# Altium project PLATE_FP_K2M_rev4_1.PrjPcb
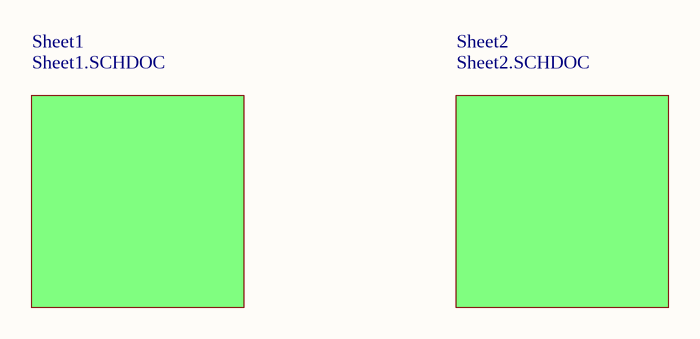
[diagram p0: First_Sheet.SCHDOC]
3 sheets, 58 parts. Net scope: global (net labels, ports and power ports of the same name join across sheets).
Board file: PLATE_FP_K2M_rev4_1.PcbDoc
Sheets:
  First_Sheet.SCHDOC
    Sheet1 = Sheet1.SCHDOC
    Sheet2 = Sheet2.SCHDOC

## Sheet First_Sheet.SCHDOC
size 421 x 298 mm

### Sub-sheets
Sheet1 = Sheet1.SCHDOC: no entries
Sheet2 = Sheet2.SCHDOC: no entries

## Sheet Sheet1.SCHDOC
size 421 x 298 mm; Revision: Rev.4.1; SheetNumber: 1; SheetTotal: 2; DocumentName: Sheet1.SCHDOC
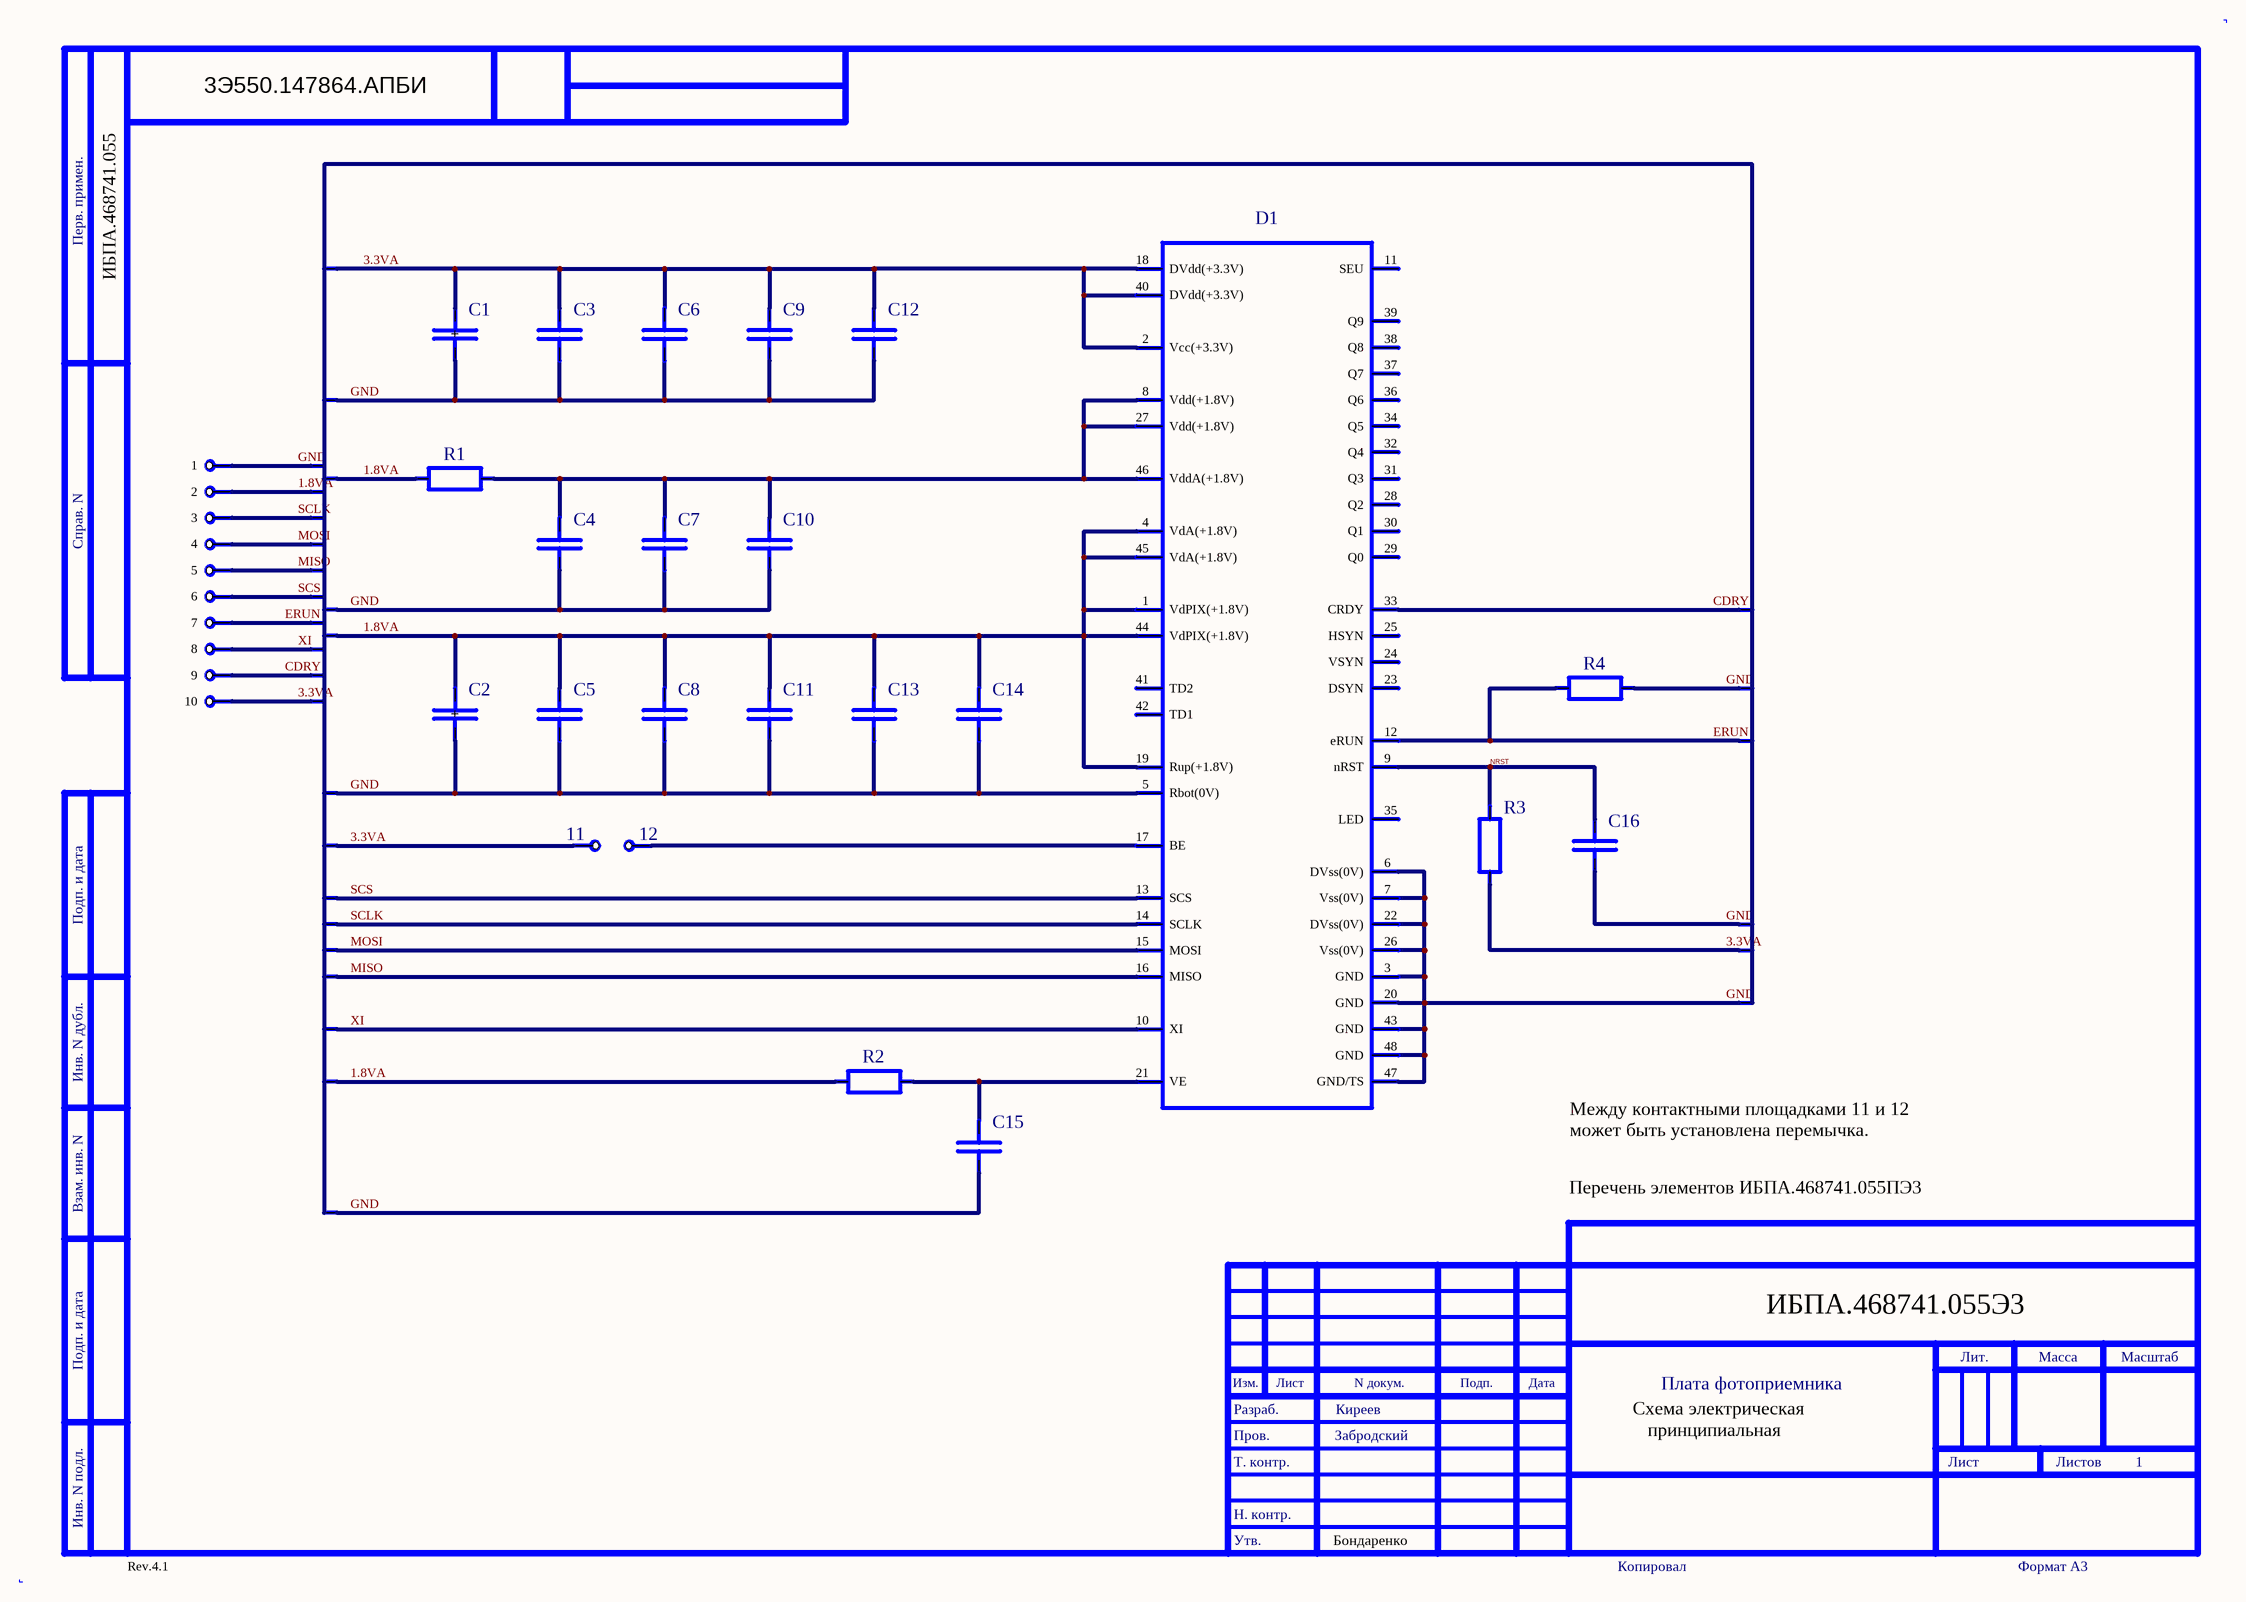
[diagram p1: Sheet1.SCHDOC]

### Parts
11  CONT_D1.0(0.6)MM  [CONT_D1.0(0.6)MM]  (value not drawn)
12  CONT_D1.0(0.6)MM  [CONT_D1.0(0.6)MM]  (value not drawn)
C1  K53-56A_3628M_2B  [CE_3628M_B]  (value not drawn)
C2  K53-56A_3628M_2B  [CE_3628M_B]  (value not drawn)
C3  K10-84B_1608M_I  [1608M_I]  (value not drawn)
C4  K10-84B_2012M_IV  [2012M_IV]  (value not drawn)
C5  K10-84B_2012M_IV  [2012M_IV]  (value not drawn)
C6  K10-84B_2012M_IV  [2012M_IV]  (value not drawn)
C7  K10-84B_2012M_IV  [2012M_IV]  (value not drawn)
C8  K10-84B_2012M_IV  [2012M_IV]  (value not drawn)
C9  K10-84B_2012M_IV  [2012M_IV]  (value not drawn)
C10  K10-84B_2012M_IV  [2012M_IV]  (value not drawn)
C11  K10-84B_2012M_IV  [2012M_IV]  (value not drawn)
C12  K10-84B_2012M_IV  [2012M_IV]  (value not drawn)
C13  K10-84B_2012M_IV  [2012M_IV]  (value not drawn)
C14  K10-84B_2012M_IV  [2012M_IV]  (value not drawn)
C15  K10-84B_2012M_IV  [2012M_IV]  (value not drawn)
C16  K10-84B_2012M_IV  [2012M_IV]  (value not drawn)
D1  UIC1203R  [CERAMIC_JLCC-48]  (value not drawn)
OFF1  BUS_CONNECTOR  (value not drawn)  (graphical)
OFF2  BUS_CONNECTOR  (value not drawn)  (graphical)
OFF3  BUS_CONNECTOR  (value not drawn)  (graphical)
OFF4  BUS_CONNECTOR  (value not drawn)  (graphical)
OFF5  BUS_CONNECTOR  (value not drawn)  (graphical)
OFF6  BUS_CONNECTOR  (value not drawn)  (graphical)
OFF7  BUS_CONNECTOR  (value not drawn)  (graphical)
OFF8  BUS_CONNECTOR  (value not drawn)  (graphical)
OFF9  BUS_CONNECTOR  (value not drawn)  (graphical)
OFF10  BUS_CONNECTOR  (value not drawn)  (graphical)
OFF11  BUS_CONNECTOR  (value not drawn)  (graphical)
OFF12  BUS_CONNECTOR  (value not drawn)  (graphical)
OFF13  BUS_CONNECTOR  (value not drawn)  (graphical)
OFF14  BUS_CONNECTOR  (value not drawn)  (graphical)
OFF15  BUS_CONNECTOR  (value not drawn)  (graphical)
OFF16  BUS_CONNECTOR  (value not drawn)  (graphical)
OFF17  BUS_CONNECTOR  (value not drawn)  (graphical)
OFF18  BUS_CONNECTOR  (value not drawn)  (graphical)
OFF19  BUS_CONNECTOR  (value not drawn)  (graphical)
OFF20  BUS_CONNECTOR  (value not drawn)  (graphical)
OFF21  BUS_CONNECTOR  (value not drawn)  (graphical)
OFF22  BUS_CONNECTOR  (value not drawn)  (graphical)
OFF23  BUS_CONNECTOR  (value not drawn)  (graphical)
OFF24  BUS_CONNECTOR  (value not drawn)  (graphical)
OFF25  BUS_CONNECTOR  (value not drawn)  (graphical)
OFF26  BUS_CONNECTOR  (value not drawn)  (graphical)
OFF27  BUS_CONNECTOR  (value not drawn)  (graphical)
OFF28  BUS_CONNECTOR  (value not drawn)  (graphical)
OFF29  BUS_CONNECTOR  (value not drawn)  (graphical)
OFF30  BUS_CONNECTOR  (value not drawn)  (graphical)
R1  P1-12-0,125_2012M  [R1-12_2012M_0805]  (value not drawn)
R2  P1-12-0,125_2012M  [R1-12_2012M_0805]  (value not drawn)
R3  P1-12-0,125_2012M  [R1-12_2012M_0805]  (value not drawn)
R4  P1-12-0,125_2012M  [R1-12_2012M_0805]  (value not drawn)
TP1  TMM-105-01-T-D  [TMM-105-01-G-D_SAMTEC]  (value not drawn)

### Nets
1.8VA: C2.1(+) C5.1 C8.1 C11.1 C13.1 C14.1 D1.1(VdPIX(+1.8V)) D1.4(VdA(+1.8V)) D1.19(Rup(+1.8V)) D1.44(VdPIX(+1.8V)) D1.45(VdA(+1.8V)) OFF2.1 OFF13.1 OFF15.1 OFF22.1 R1.1 R2.1 TP1.2
3.3VA: 11.1 C1.1(+) C3.1 C6.1 C9.1 C12.1 D1.2(Vcc(+3.3V)) D1.18(DVdd(+3.3V)) D1.40(DVdd(+3.3V)) OFF10.1 OFF11.1 OFF27.1 OFF30.1 R3.2 TP1.10
CDRY: D1.33(CRDY) OFF9.1 OFF23.1 TP1.9
ERUN: D1.12(eRUN) OFF7.1 OFF25.1 R4.1 TP1.7
GND: C1.2 C2.2 C3.2 C4.2 C5.2 C6.2 C7.2 C8.2 C9.2 C10.2 C11.2 C12.2 C13.2 C14.2 C15.2 C16.2 D1.3(GND) D1.5(Rbot(0V)) D1.6(DVss(0V)) D1.7(Vss(0V)) D1.20(GND) D1.22(DVss(0V)) D1.26(Vss(0V)) D1.43(GND) D1.47(GND/TS) D1.48(GND) OFF1.1 OFF12.1 OFF14.1 OFF16.1 OFF24.1 OFF26.1 OFF28.1 OFF29.1 R4.2 TP1.1
MISO: D1.16(MISO) OFF5.1 OFF20.1 TP1.5
MOSI: D1.15(MOSI) OFF4.1 OFF19.1 TP1.4
NRST: C16.1 D1.9(nRST) R3.1
SCLK: D1.14(SCLK) OFF3.1 OFF18.1 TP1.3
SCS: D1.13(SCS) OFF6.1 OFF17.1 TP1.6
XI: D1.10(XI) OFF8.1 OFF21.1 TP1.8
Net12_1: 12.1 D1.17(BE)
NetC4_1: C4.1 C7.1 C10.1 D1.8(Vdd(+1.8V)) D1.27(Vdd(+1.8V)) D1.46(VddA(+1.8V)) R1.2
NetC15_1: C15.1 D1.21(VE) R2.2

Not connected (* = marked no-connect by the designer): D1 11(SEU) 23(DSYN) 24(VSYN) 25(HSYN) 28(Q2) 29(Q0) 30(Q1) 31(Q3) 32(Q4) 34(Q5) 35(LED) 36(Q6) 37(Q7) 38(Q8) 39(Q9) 41(TD2) 42(TD1)

### Notes on the sheet
- 3Э550.147864.АПБИ
- Перв. примен.
- ИБПА.468741.055
- Справ. N
- Подп. и дата
- Инв. N дубл.
- Взам. инв. N
- Между контактными площадками 11 и 12
  может быть установлена перемычка.
- Перечень элементов ИБПА.468741.055ПЭ3
- ИБПА.468741.055Э3
- Разраб.
- Изм.
- Лист
- Киреев
- N докум.
- Подп.
- Дата
- Плата фотоприемника
- Лит.
- Масса
- Масштаб
- Т. контр.
- Пров.
- Забродский
- Схема электрическая
  принципиальная
- Листов
- 1
- Инв. N подл.
- Утв.
- Н. контр.
- Бондаренко
- Копировал
- Формат А3

### Library data of the parts
C1 C2 = K53-56A_3628M_2B: {Description}; Part Number: ОСМ К53-56А - 10 В - 10 мкФ ±10 % - В; Value: 10 мкФ х 10 В; Vendor: АЖЯР.673546.001ТУ П0.070.052
C3 = K10-84B_1608M_I: {Description}; Part Number: К10-84в - 1608М - 16 В - Н90 - 0,01 мкФ; Value: 0,01 мкФ х 16 В; Vendor: ФЦТА.673516.016ТУ
C4-C16 = K10-84B_2012M_IV: {Description}; Part Number: К10-84в - 2012М - 25 В - Н90 - 0,1 мкФ; Value: 0,1 мкФ; Vendor: ФЦТА.673516.016ТУ
D1 = UIC1203R: {Description}; Part Number: UI1203R; Vendor: ф. Jatronics Sdn. Bhd.
OFF1 OFF12 OFF14 OFF16 OFF24 OFF26 OFF28 OFF29 = BUS_CONNECTOR: Value: GND
OFF2 OFF13 OFF15 OFF22 = BUS_CONNECTOR_VARIANT_1: Value: 1.8VA
OFF3 OFF18 = BUS_CONNECTOR_VARIANT_2: Value: SCLK
OFF4 OFF19 = BUS_CONNECTOR_VARIANT_2: Value: MOSI
OFF5 OFF20 = BUS_CONNECTOR_VARIANT_2: Value: MISO
OFF6 OFF17 = BUS_CONNECTOR_VARIANT_2: Value: SCS
OFF7 OFF25 = BUS_CONNECTOR_VARIANT_2: Value: ERUN
OFF8 OFF21 = BUS_CONNECTOR_VARIANT_2: Value: XI
OFF9 OFF23 = BUS_CONNECTOR_VARIANT_2: Value: CDRY
OFF10 OFF11 OFF27 OFF30 = BUS_CONNECTOR_VARIANT_1: Value: 3.3VA
R1 = P1-12-0,125_2012M: {Description}; Part Number: ОСМ Р1-12 - 0,125 - 75 Ом ±5% - М - А; Value: 75 Ом; Vendor: АЛЯР.434110.005ТУ  РД В 22.02.218-2007
R2 = P1-12-0,125_2012M: {Description}; Part Number: ОСМ Р1-12 - 0,125 - 1 кОм ±5% - М - А; Value: 1 кОм; Vendor: АЛЯР.434110.005ТУ  РД В 22.02.218-2007
R3 = P1-12-0,125_2012M: {Description}; Part Number: ОСМ Р1-12 - 0,125 - 3 кОм ±5% - М - А; Value: 3 кОм; Vendor: АЛЯР.434110.005ТУ  РД В 22.02.218-2007
R4 = P1-12-0,125_2012M: {Description}; Part Number: ОСМ Р1-12 - 0,125 - 20 кОм ±5% - М - А; Value: 20 кОм; Vendor: АЛЯР.434110.005ТУ  РД В 22.02.218-2007
TP1 = TMM-105-01-T-D: {Description}; Part Number: {Part Number}; Vendor: {Vendor}; Name: {Name}

## Sheet Sheet2.SCHDOC
size 421 x 298 mm; SheetNumber: 2; SheetTotal: 2; DocumentName: Sheet2.SCHDOC
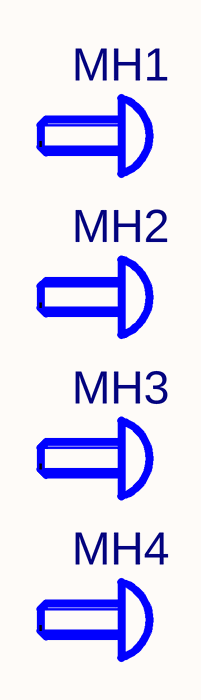
[diagram p2: Sheet2.SCHDOC]

### Parts
MH1  MH_M2.0_NONPLATED  [MH_M2.0_NONPLATED]  (value not drawn)
MH2  MH_M2.0_NONPLATED  [MH_M2.0_NONPLATED]  (value not drawn)
MH3  MH_M2.0_NONPLATED  [MH_M2.0_NONPLATED]  (value not drawn)
MH4  MH_M2.0_NONPLATED  [MH_M2.0_NONPLATED]  (value not drawn)

### Nets

Not connected (* = marked no-connect by the designer): MH1 1; MH2 1; MH3 1; MH4 1